# Altium schematic sheet OptodeConnectors.SchDoc: fNIRS - Optode Connectors
size A4; CompanyName: UofT Capstone Team 2024991; DrawnBy: Tony Kim; Revision: 1; SheetNumber: 13; SheetTotal: 13
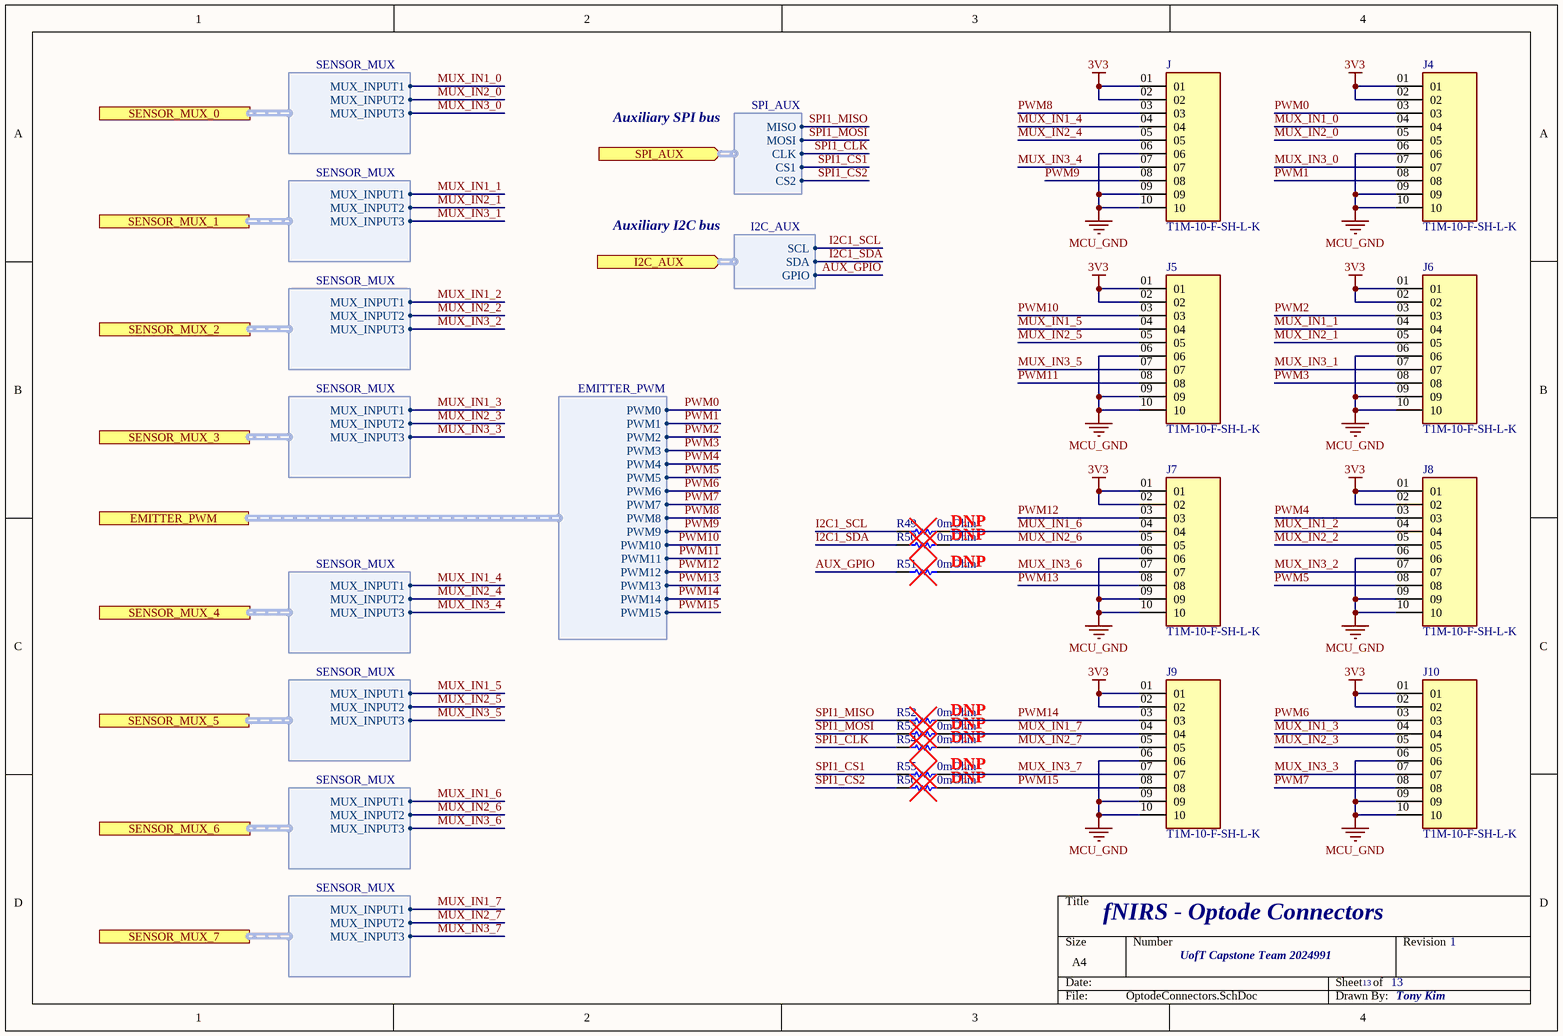
[diagram p0: OptodeConnectors.SchDoc]

## Parts
J  T1M-10-F-SH-L-K  [SAMTEC_T1M-10-F-SH-L-K]
J4  T1M-10-F-SH-L-K  [SAMTEC_T1M-10-F-SH-L-K]
J5  T1M-10-F-SH-L-K  [SAMTEC_T1M-10-F-SH-L-K]
J6  T1M-10-F-SH-L-K  [SAMTEC_T1M-10-F-SH-L-K]
J7  T1M-10-F-SH-L-K  [SAMTEC_T1M-10-F-SH-L-K]
J8  T1M-10-F-SH-L-K  [SAMTEC_T1M-10-F-SH-L-K]
J9  T1M-10-F-SH-L-K  [SAMTEC_T1M-10-F-SH-L-K]
J10  T1M-10-F-SH-L-K  [SAMTEC_T1M-10-F-SH-L-K]
R49  Resistance: 0mOhm  [RESC1608X55X25ML10T15]  (hidden comment: RC0603JR-070RL)  (no BOM)
R50  Resistance: 0mOhm  [RESC1608X55X25ML10T15]  (hidden comment: RC0603JR-070RL)  (no BOM)
R51  Resistance: 0mOhm  [RESC1608X55X25ML10T15]  (hidden comment: RC0603JR-070RL)  (no BOM)
R52  Resistance: 0mOhm  [RESC1608X55X25ML10T15]  (hidden comment: RC0603JR-070RL)  (no BOM)
R53  Resistance: 0mOhm  [RESC1608X55X25ML10T15]  (hidden comment: RC0603JR-070RL)  (no BOM)
R54  Resistance: 0mOhm  [RESC1608X55X25ML10T15]  (hidden comment: RC0603JR-070RL)  (no BOM)
R55  Resistance: 0mOhm  [RESC1608X55X25ML10T15]  (hidden comment: RC0603JR-070RL)  (no BOM)
R56  Resistance: 0mOhm  [RESC1608X55X25ML10T15]  (hidden comment: RC0603JR-070RL)  (no BOM)

## Ports
EMITTER_PWM (harness EMITTER_PWM, see Connectors[5B]), I2C_AUX (in, harness I2C_AUX, see Connectors[5B], Connectors[7B], MCU[1B]), SENSOR_MUX_0 (harness SENSOR_MUX, see Connectors[4B]), SENSOR_MUX_1 (harness SENSOR_MUX, see Connectors[4B]), SENSOR_MUX_2 (harness SENSOR_MUX, see Connectors[4B]), SENSOR_MUX_3 (harness SENSOR_MUX, see Connectors[4B]), SENSOR_MUX_4 (harness SENSOR_MUX, see Connectors[4B]), SENSOR_MUX_5 (harness SENSOR_MUX, see Connectors[4B]), SENSOR_MUX_6 (harness SENSOR_MUX, see Connectors[4B]), SENSOR_MUX_7 (harness SENSOR_MUX, see Connectors[4B]), SPI_AUX (in, harness SPI_AUX, see Connectors[5B], Connectors[7B], MCU[8D])

## Harnesses
EMITTER_PWM: PWM0, PWM1, PWM2, PWM3, PWM4, PWM5, PWM6, PWM7, PWM8, PWM9, PWM10, PWM11, PWM12, PWM13, PWM14, PWM15
SENSOR_MUX: MUX_INPUT1, MUX_INPUT2, MUX_INPUT3
SPI_AUX: MISO, MOSI, CLK, CS1, CS2
I2C_AUX: SCL, SDA, GPIO

## Nets
3V3: J.01 J.02 J4.01 J4.02 J5.01 J5.02 J6.01 J6.02 J7.01 J7.02 J8.01 J8.02 J9.01 J9.02 J10.01 J10.02
MCU_GND: J.06 J.09 J.10 J4.06 J4.09 J4.10 J5.06 J5.09 J5.10 J6.06 J6.09 J6.10 J7.06 J7.09 J7.10 J8.06 J8.09 J8.10 J9.06 J9.09 J9.10 J10.06 J10.09 J10.10
AUX_GPIO: R51.2 ; port I2C_AUX.GPIO
I2C1_SCL: R49.2 ; port I2C_AUX.SCL
I2C1_SDA: R50.2 ; port I2C_AUX.SDA
MUX_IN1_0: J4.04 ; port SENSOR_MUX_0.MUX_INPUT1
MUX_IN1_1: J6.04 ; port SENSOR_MUX_1.MUX_INPUT1
MUX_IN1_2: J8.04 ; port SENSOR_MUX_2.MUX_INPUT1
MUX_IN1_3: J10.04 ; port SENSOR_MUX_3.MUX_INPUT1
MUX_IN1_4: J.04 ; port SENSOR_MUX_4.MUX_INPUT1
MUX_IN1_5: J5.04 ; port SENSOR_MUX_5.MUX_INPUT1
MUX_IN1_6: J7.04 R49.1 ; port SENSOR_MUX_6.MUX_INPUT1
MUX_IN1_7: J9.04 R53.1 ; port SENSOR_MUX_7.MUX_INPUT1
MUX_IN2_0: J4.05 ; port SENSOR_MUX_0.MUX_INPUT2
MUX_IN2_1: J6.05 ; port SENSOR_MUX_1.MUX_INPUT2
MUX_IN2_2: J8.05 ; port SENSOR_MUX_2.MUX_INPUT2
MUX_IN2_3: J10.05 ; port SENSOR_MUX_3.MUX_INPUT2
MUX_IN2_4: J.05 ; port SENSOR_MUX_4.MUX_INPUT2
MUX_IN2_5: J5.05 ; port SENSOR_MUX_5.MUX_INPUT2
MUX_IN2_6: J7.05 R50.1 ; port SENSOR_MUX_6.MUX_INPUT2
MUX_IN2_7: J9.05 R54.1 ; port SENSOR_MUX_7.MUX_INPUT2
MUX_IN3_0: J4.07 ; port SENSOR_MUX_0.MUX_INPUT3
MUX_IN3_1: J6.07 ; port SENSOR_MUX_1.MUX_INPUT3
MUX_IN3_2: J8.07 ; port SENSOR_MUX_2.MUX_INPUT3
MUX_IN3_3: J10.07 ; port SENSOR_MUX_3.MUX_INPUT3
MUX_IN3_4: J.07 ; port SENSOR_MUX_4.MUX_INPUT3
MUX_IN3_5: J5.07 ; port SENSOR_MUX_5.MUX_INPUT3
MUX_IN3_6: J7.07 R51.1 ; port SENSOR_MUX_6.MUX_INPUT3
MUX_IN3_7: J9.07 R55.1 ; port SENSOR_MUX_7.MUX_INPUT3
PWM0: J4.03 ; port EMITTER_PWM.PWM0
PWM1: J4.08 ; port EMITTER_PWM.PWM1
PWM2: J6.03 ; port EMITTER_PWM.PWM2
PWM3: J6.08 ; port EMITTER_PWM.PWM3
PWM4: J8.03 ; port EMITTER_PWM.PWM4
PWM5: J8.08 ; port EMITTER_PWM.PWM5
PWM6: J10.03 ; port EMITTER_PWM.PWM6
PWM7: J10.08 ; port EMITTER_PWM.PWM7
PWM8: J.03 ; port EMITTER_PWM.PWM8
PWM9: J.08 ; port EMITTER_PWM.PWM9
PWM10: J5.03 ; port EMITTER_PWM.PWM10
PWM11: J5.08 ; port EMITTER_PWM.PWM11
PWM12: J7.03 ; port EMITTER_PWM.PWM12
PWM13: J7.08 ; port EMITTER_PWM.PWM13
PWM14: J9.03 R52.1 ; port EMITTER_PWM.PWM14
PWM15: J9.08 R56.1 ; port EMITTER_PWM.PWM15
SPI1_CLK: R54.2 ; port SPI_AUX.CLK
SPI1_CS1: R55.2 ; port SPI_AUX.CS1
SPI1_CS2: R56.2 ; port SPI_AUX.CS2
SPI1_MISO: R52.2 ; port SPI_AUX.MISO
SPI1_MOSI: R53.2 ; port SPI_AUX.MOSI

## Notes on the sheet
- Auxiliary SPI bus
- Auxiliary I2C bus
- DNP

## Library data of the parts
J J4-J10 = T1M-10-F-SH-L-K: MF: Samtec; Value: *; Package: None; MP: T1M-10-F-SH-L-K; Price: None; Availability: Unavailable
R49-R56 = CMP-2100-03667-1: Chip Resistor, 0 Ohm, +/- 5%, 0.1 W, -55 to 155 degC, 0603 (1608 Metric), RoHS, Tape and Reel; Manufacturer: Yageo; Temperature Coefficient: 200ppm/degreesC; Voltage Rating: 50V; Power Rating: 100mW; Width: 0.8mm; Max Operating Temperature: 155degC; Tolerance: 5%; Package Reference: 0603; Height: 0.45mm; Depth: 0.8mm; Package Description: 2-Pin Surface Mount Device, Body 1.6 x 0.8 mm; Termination: SMD/SMT; Package Quantity: 5000; Case/Package: 0603; Case Code (Imperial): 0603; Radiation Hardening: No; Number of Pins: 2; Length: 1.6mm; Lead Free: LeadFree; Voltage Rating (DC): 50V; Military Standard: Not; Datasheet URL: http://www.yageo.com/NewPortal/yageodocoutput?fileName=/pdf/R-Chip/PYu-RC_Group_51_RoHS_L_5.pdf; Manufacturer URL: http://www.yageo.com/; Packaging: TapeandReel; Case Code (Metric): 1608; Min Operating Temperature: -55degC; Composition: ThickFilm; RoHSCompliant: true; Contact Plating: Tin; Datasheet Version: Rev. 5, 10/2016; REACH SVHC: NoSVHC